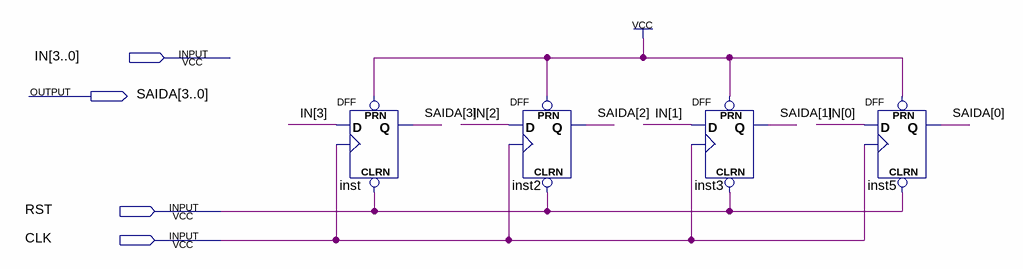
[diagram p0: schematic sheet]
// Quartus schematic REGISTRO_4BITS.bdf as structural Verilog: 4 symbols, 4 pins
module REGISTRO_4BITS (
  input  [3:0] IN,
  input  RST,
  input  CLK,
  output [3:0] SAIDA
);

  DFF inst (.CLRN(RST), .CLK(CLK), .D(IN[3]), .PRN(1'b1), .Q(SAIDA[3]));
  DFF inst2 (.CLRN(RST), .CLK(CLK), .D(IN[2]), .PRN(1'b1), .Q(SAIDA[2]));
  DFF inst3 (.CLRN(RST), .CLK(CLK), .D(IN[1]), .PRN(1'b1), .Q(SAIDA[1]));
  DFF inst5 (.CLRN(RST), .CLK(CLK), .D(IN[0]), .PRN(1'b1), .Q(SAIDA[0]));
endmodule
